# Altium schematic sheet THERMISTOR_SHEET.SchDoc
size A4; Organization: Waterloop; Address1: 200 University Ave W; Address2: Engineering 5, 1104; Address3: Waterloo, ON; Address4: N2L 3G1; SheetNumber: 4; SheetTotal: 4
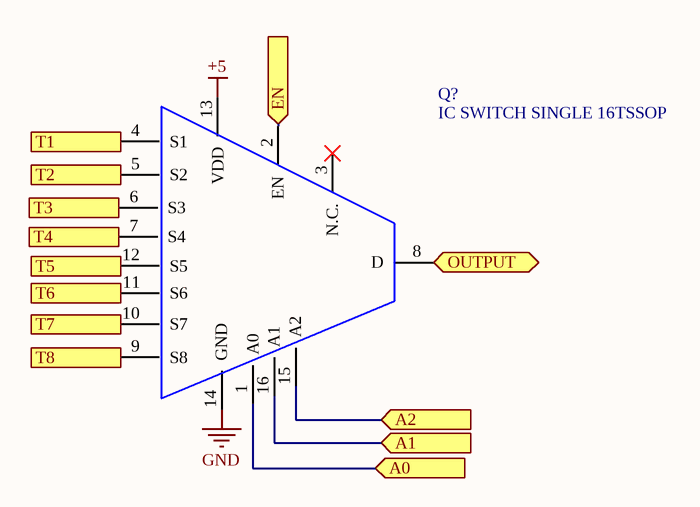
[diagram p0: THERMISTOR_SHEET.SchDoc]

## Parts
Q?  IC SWITCH SINGLE 16TSSOP  [SOT50P160X90-3N]

## Ports
A0 (in, see Monitoring IC[3C]), A1 (in, see Monitoring IC[3C]), A2 (in, see Monitoring IC[3C]), EN (in, see Monitoring IC[3C]), OUTPUT (bidir, see Monitoring IC[3C]), T1 (in, see Monitoring IC[3C]), T2 (in, see Monitoring IC[3C]), T3 (in, see Monitoring IC[3C]), T4 (in, see Monitoring IC[3C]), T5 (in, see Monitoring IC[3C]), T6 (in, see Monitoring IC[3C]), T7 (in, see Monitoring IC[3D]), T8 (in, see Monitoring IC[3D])

## Nets
+5: Q?.13(VDD)
GND: Q?.14(GND)
A0: Q?.1(A0) ; port A0
A1: Q?.16(A1) ; port A1
A2: Q?.15(A2) ; port A2
EN: Q?.2(EN) ; port EN
OUTPUT: Q?.8(D) ; port OUTPUT
T1: Q?.4(S1) ; port T1
T2: Q?.5(S2) ; port T2
T3: Q?.6(S3) ; port T3
T4: Q?.7(S4) ; port T4
T5: Q?.12(S5) ; port T5
T6: Q?.11(S6) ; port T6
T7: Q?.10(S7) ; port T7
T8: Q?.9(S8) ; port T8

Not connected (* = marked no-connect by the designer): Q? 3(N.C.)*

## Notes on the sheet
- Title:
- Size:
- Date:
- A4
- Author:
- Revision:
- Sheet
- of
- File:

## Library data of the parts
Q? = TMUX1208PWR: 1 Circuit IC Switch 8:1 3Ohm (Typ) 16-TSSOP; Manufacturer_Name: TI; Datasheet Link: https://www.ti.com/general/docs/suppproductinfo.tsp?distId=10&gotoUrl=https%3A%2F%2Fwww.ti.com%2Flit%2Fgpn%2Ftmux1208; Manufacturer_Part_Number: TMUX1208PWR; Mouser Part Number: 296-51847-1-ND; Mouser Price/Stock: https://www.digikey.ca/en/products/detail/texas-instruments/TMUX1208PWR/9665932; Arrow Part Number: DMN2004TK-7; Arrow Price/Stock: https://www.arrow.com/en/products/dmn2004tk-7/diodes-incorporated; Datasheet: https://www.diodes.com/assets/Datasheets/ds30936.pdf